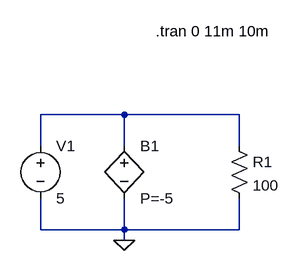
[diagram p0: schematic Const_Power_Test.asc]
Const_Power_Test.asc, the LTspice schematic file:
Version 4
SHEET 1 880 680
WIRE 48 64 -80 64
WIRE 224 64 48 64
WIRE -80 112 -80 64
WIRE 48 112 48 64
WIRE 224 112 224 64
WIRE -80 240 -80 192
WIRE 48 240 48 192
WIRE 48 240 -80 240
WIRE 224 240 224 192
WIRE 224 240 48 240
WIRE 48 256 48 240
FLAG 48 256 0
SYMBOL bv 48 96 R0
SYMATTR InstName B1
SYMATTR Value P=-5
SYMBOL res 208 96 R0
SYMATTR InstName R1
SYMATTR Value 100
SYMBOL voltage -80 96 R0
SYMATTR InstName V1
SYMATTR Value 5
TEXT 96 -64 Left 2 !.tran 0 11m 10m

The netlist it stands for:
* Const_Power_Test.asc
B1 N001 0 P=-5
R1 N001 0 100
V1 N001 0 5
.tran 0 11m 10m
.backanno
.end